# EAGLE schematic bc-module-core (EAGLE 7.7.0)

## Sheet 1 of 2
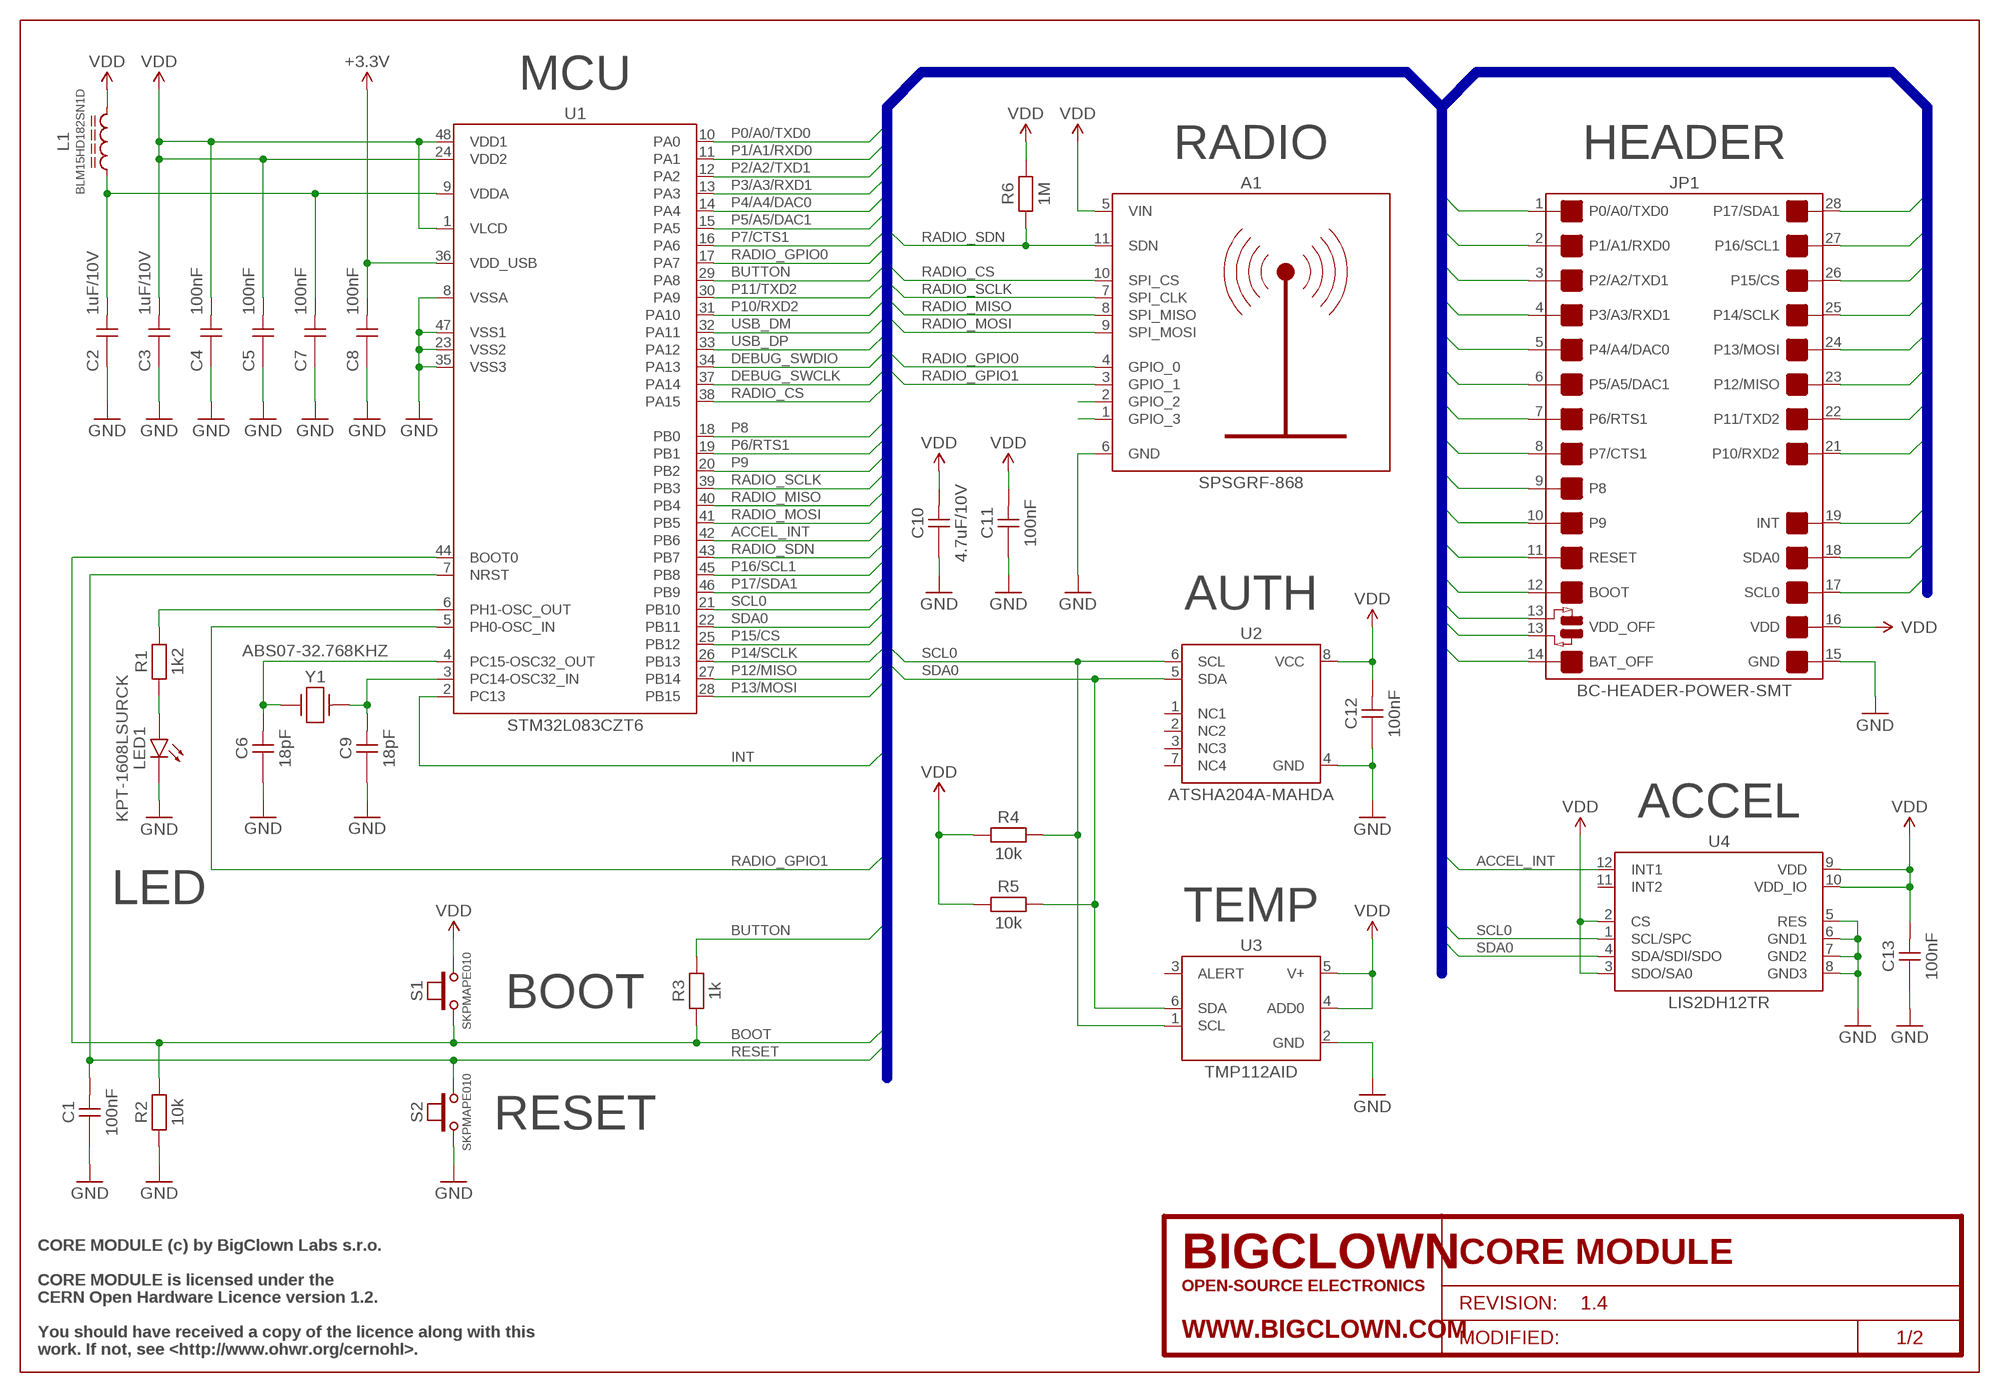
[diagram p0: schematic, sheet 1]

### Parts
A1  SPSGRF-868  A-SPSGRF  [SPSGRF_R]
C1  100nF  C-0402-100NF  [CAPACITOR-0402_R]
C2  1uF/10V  C-0402-1UF-10V  [CAPACITOR-0402_R]
C3  1uF/10V  C-0402-1UF-10V  [CAPACITOR-0402_R]
C4  100nF  C-0402-100NF  [CAPACITOR-0402_R]
C5  100nF  C-0402-100NF  [CAPACITOR-0402_R]
C6  18pF  C-0402-18PF  [CAPACITOR-0402_R]
C7  100nF  C-0402-100NF  [CAPACITOR-0402_R]
C8  100nF  C-0402-100NF  [CAPACITOR-0402_R]
C9  18pF  C-0402-18PF  [CAPACITOR-0402_R]
C10  4.7uF/10V  C-0402-4.7UF-10V  [CAPACITOR-0402_R]
C11  100nF  C-0402-100NF  [CAPACITOR-0402_R]
C12  100nF  C-0402-100NF  [CAPACITOR-0402_R]
C13  100nF  C-0402-100NF  [CAPACITOR-0402_R]
FRAME1  FRAME-SCH/A4L-BRD/A4L  [FRAME-A4L]
JP1  BC-HEADER-POWER-SMT  [BC-HEADER-POWER-SMT]
L1  BLM15HD182SN1D  L-BLM15HD182SN1D  [INDUCTOR-0402_R]
LED1  KPT-1608LSURCK  LED-KPT-1608LSURCK  [KPT-1608LSURCK_R]
R1  1k2  R-0402-1K2  [RESISTOR-0402_R]
R2  10k  R-0402-10K  [RESISTOR-0402_R]
R3  1k  R-0402-1K  [RESISTOR-0402_R]
R4  10k  R-0402-10K  [RESISTOR-0402_R]
R5  10k  R-0402-10K  [RESISTOR-0402_R]
R6  1M  R-0402-1M  [RESISTOR-0402_R]
S1  SKPMAPE010  S-SKPMAPE010  [SKPMAPE010_R]
S2  SKPMAPE010  S-SKPMAPE010  [SKPMAPE010_R]
U1  STM32L083CZT6  U-STM32L083CZT6  [STM32L083CZT6_R]
U2  ATSHA204A-MAHDA  U-ATSHA204A-MAHDA  [ATSHA204A-MAHDA_R]
U3  TMP112AID  U-TMP112AID  [TMP112AID_R]
U4  LIS2DH12TR  U-LIS2DH12TR  [LIS2DH12TR_R]
Y1  ABS07-32.768KHZ  Y-ABS07-32.768KHZ  [ABS07-32.768KHZ_R]

### Nets
+3.3V: C8.1 U1.36(VDD_USB) ; also sheet 2
ACCEL_INT: U1.42(PB6) U4.12(INT1)
BAT_OFF: JP1.14(BAT_OFF) ; also sheet 2
BOOT: JP1.12(BOOT) R2.2 R3.1 S1.1 U1.44(BOOT0)
BUTTON: R3.2 U1.29(PA8)
DEBUG_SWCLK: U1.37(PA14) ; also sheet 2
DEBUG_SWDIO: U1.34(PA13) ; also sheet 2
GND: A1.6(GND) C1.2 C2.2 C3.2 C4.2 C5.2 C6.2 C7.2 C8.2 C9.2 C10.2 C11.2 C12.2 C13.2 JP1.15(GND) LED1.C R2.1 S2.1 U1.8(VSSA) U1.23(VSS2) U1.35(VSS3) U1.47(VSS1) U2.4(GND) U3.2(GND) U4.5(RES) U4.6(GND1) U4.7(GND2) U4.8(GND3) ; also sheet 2
INT: JP1.19(INT) U1.2(PC13)
LED: R1.2 U1.6(PH1-OSC_OUT)
LED_ANODE: LED1.A R1.1
OSC32_IN: C9.1 U1.3(PC14-OSC32_IN) Y1.1
OSC32_OUT: C6.1 U1.4(PC15-OSC32_OUT) Y1.2
P0/A0/TXD0: JP1.1(P0/A0/TXD0) U1.10(PA0)
P1/A1/RXD0: JP1.2(P1/A1/RXD0) U1.11(PA1)
P2/A2/TXD1: JP1.3(P2/A2/TXD1) U1.12(PA2)
P3/A3/RXD1: JP1.4(P3/A3/RXD1) U1.13(PA3)
P4/A4/DAC0: JP1.5(P4/A4/DAC0) U1.14(PA4)
P5/A5/DAC1: JP1.6(P5/A5/DAC1) U1.15(PA5)
P6/RTS1: JP1.7(P6/RTS1) U1.19(PB1)
P7/CTS1: JP1.8(P7/CTS1) U1.16(PA6)
P8: JP1.9(P8) U1.18(PB0)
P9: JP1.10(P9) U1.20(PB2)
P10/RXD2: JP1.21(P10/RXD2) U1.31(PA10)
P11/TXD2: JP1.22(P11/TXD2) U1.30(PA9)
P12/MISO: JP1.23(P12/MISO) U1.27(PB14)
P13/MOSI: JP1.24(P13/MOSI) U1.28(PB15)
P14/SCLK: JP1.25(P14/SCLK) U1.26(PB13)
P15/CS: JP1.26(P15/CS) U1.25(PB12)
P16/SCL1: JP1.27(P16/SCL1) U1.45(PB8)
P17/SDA1: JP1.28(P17/SDA1) U1.46(PB9)
RADIO_CS: A1.10(SPI_CS) U1.38(PA15)
RADIO_GPIO0: A1.4(GPIO_0) U1.17(PA7)
RADIO_GPIO1: A1.3(GPIO_1) U1.5(PH0-OSC_IN)
RADIO_GPIO2: A1.2(GPIO_2)
RADIO_GPIO3: A1.1(GPIO_3)
RADIO_MISO: A1.8(SPI_MISO) U1.40(PB4)
RADIO_MOSI: A1.9(SPI_MOSI) U1.41(PB5)
RADIO_SCLK: A1.7(SPI_CLK) U1.39(PB3)
RADIO_SDN: A1.11(SDN) R6.1 U1.43(PB7)
RESET: C1.1 JP1.11(RESET) S2.2 U1.7(NRST) ; also sheet 2
SCL0: JP1.17(SCL0) R4.2 U1.21(PB10) U2.6(SCL) U3.1(SCL) U4.1(SCL/SPC)
SDA0: JP1.18(SDA0) R5.2 U1.22(PB11) U2.5(SDA) U3.6(SDA) U4.4(SDA/SDI/SDO)
USB_DM: U1.32(PA11) ; also sheet 2
USB_DP: U1.33(PA12) ; also sheet 2
VDD: A1.5(VIN) C3.1 C4.1 C5.1 C10.1 C11.1 C12.1 C13.1 JP1.16(VDD) L1.2 R4.1 R5.1 R6.2 S1.2 U1.1(VLCD) U1.24(VDD2) U1.48(VDD1) U2.8(VCC) U3.4(ADD0) U3.5(V+) U4.2(CS) U4.3(SDO/SA0) U4.9(VDD) U4.10(VDD_IO) ; also sheet 2
VDD_OFF_IN: JP1.13B(VDD_OFF_OUT) ; also sheet 2
VDD_OFF_OUT: JP1.13T(VDD_OFF_IN) ; also sheet 2
VDDA: C2.1 C7.1 L1.1 U1.9(VDDA)
Unconnected: U2.1(NC1) U2.2(NC2) U2.3(NC3) U2.7(NC4) U3.3(ALERT) U4.11(INT2)

### Buses
RESET,BOOT,VDD_OFF_OUT,VDD_OFF_IN,BAT_OFF,INT,SDA0,SCL0,DEBUG_SWCLK,DEBUG_SWDIO,USB_DP,USB_DM,BUTTON,ACCEL_INT,RADIO_SDN,RADIO_CS,RADIO_SCLK,RADIO_MISO,RADIO_MOSI,RADIO_GPIO0,RADIO_GPIO1,P0/A0/TXD0,P1/A1/RXD0,P2/A2/TXD1,P3/A3/RXD1,P4/A4/DAC0,P5/A5/DAC1,P6/RTS1,P7/CTS1,P8,P9,P10/RXD2,P11/TXD2,P12/MISO,P13/MOSI,P14/SCLK,P15/CS,P16/SCL1,P17/SDA1

### Notes on the sheet
- MCU
- RADIO | HEADER
- AUTH
- ACCEL
- LED
- TEMP
- BOOT
- RESET
- CORE MODULE (c) by BigClown Labs s.r.o.
- CORE MODULE is licensed under the
- CERN Open Hardware Licence version 1.2.
- You should have received a copy of the licence along with this
- work. If not, see <http://www.ohwr.org/cernohl>.

## Sheet 2 of 2
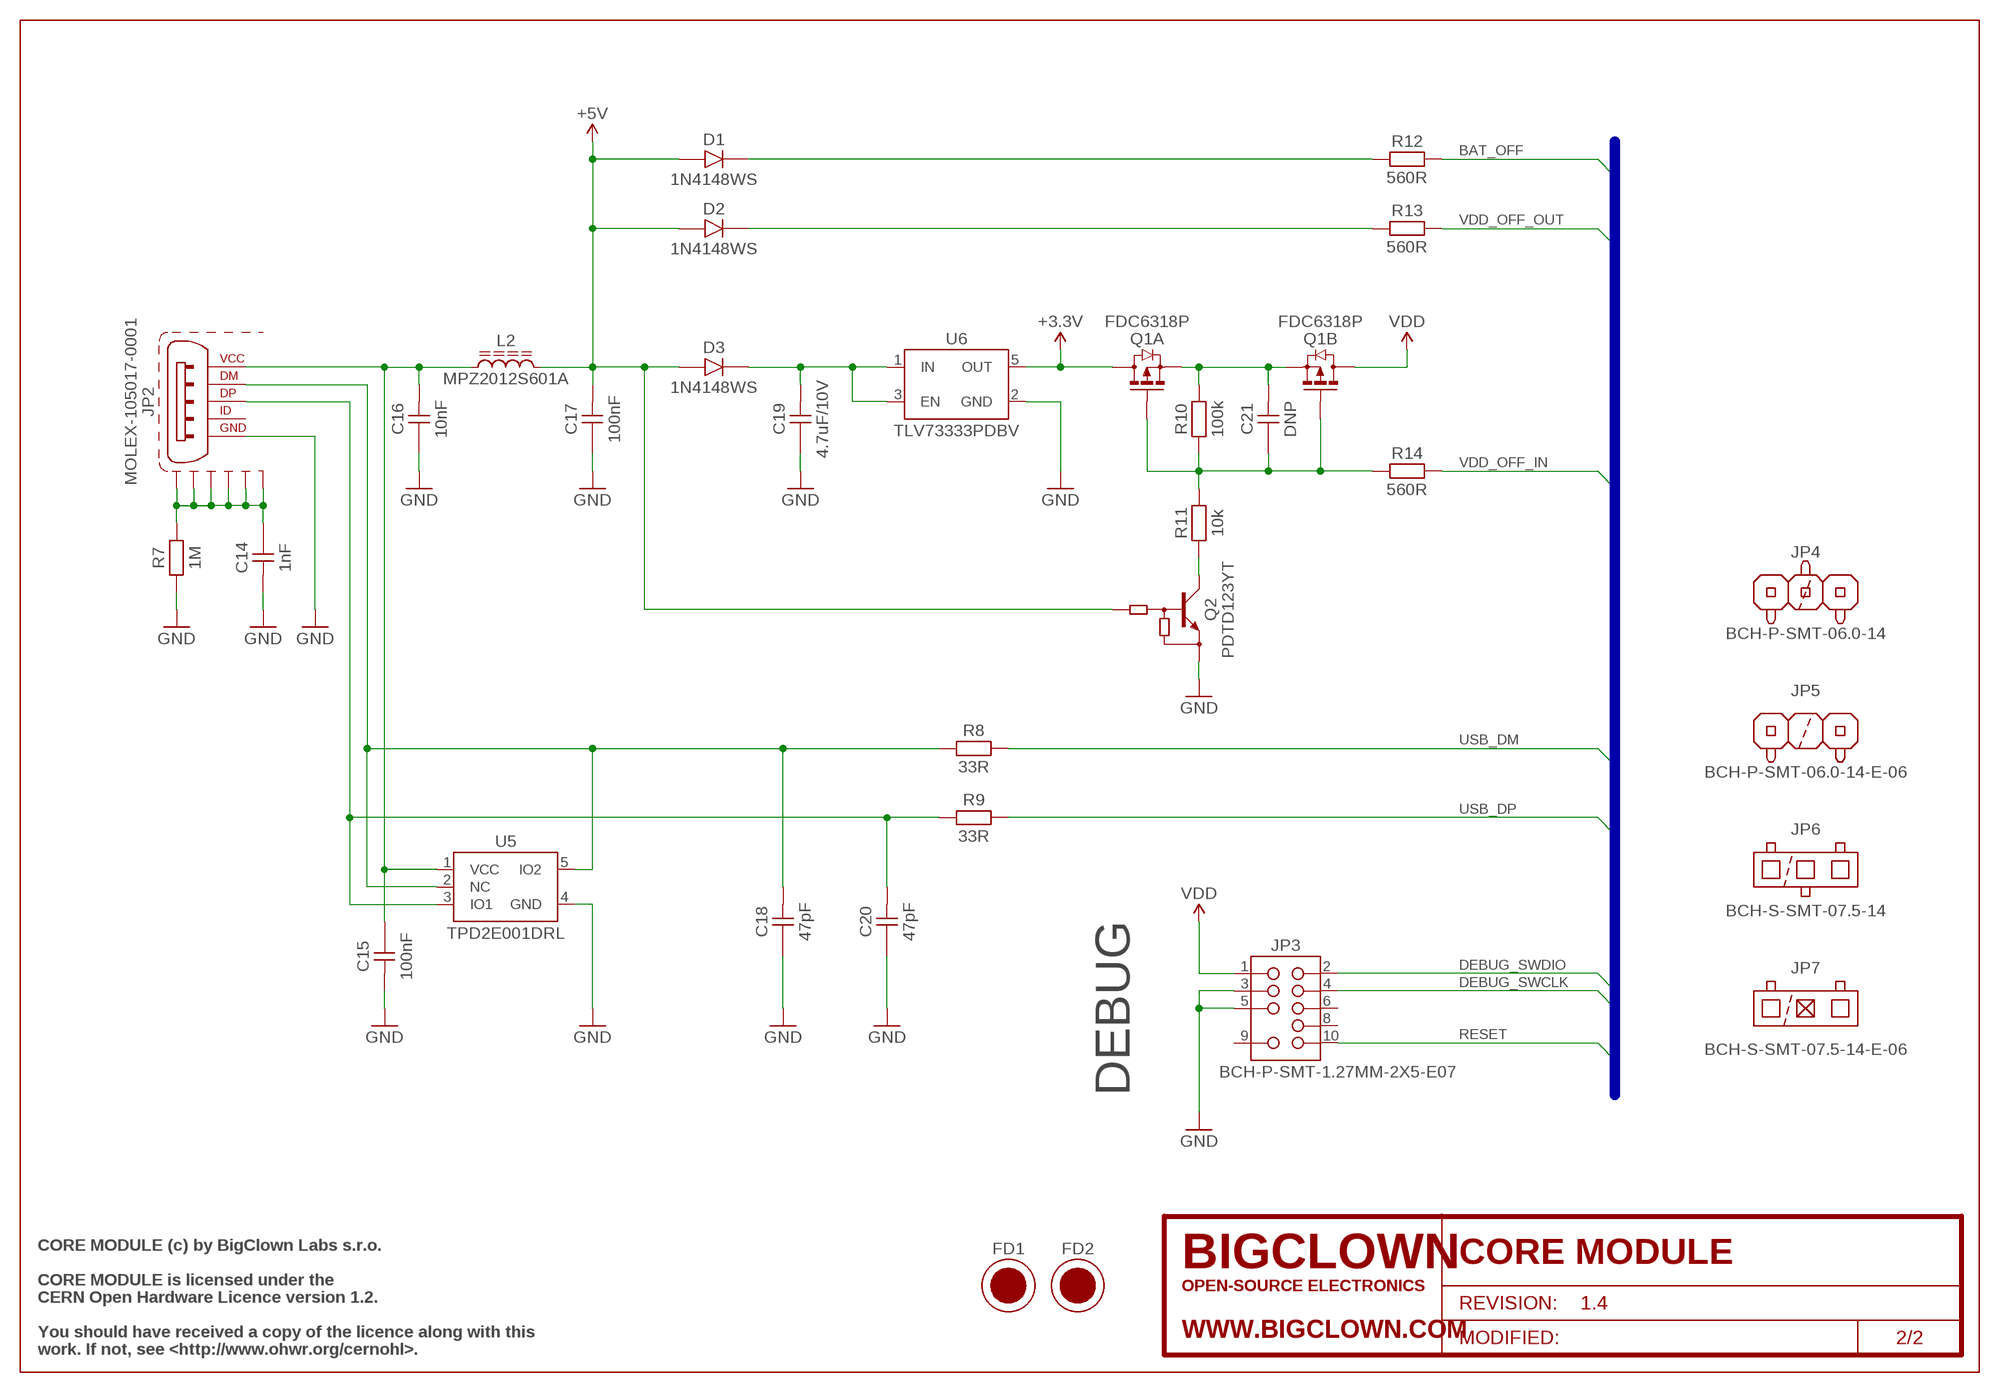
[diagram p1: schematic, sheet 2]
FRAME2 (FRAME-SCH/A4L-BRD/NONE): BCPN: -; PROJECT_NAME: CORE MODULE; PROJECT_REVISION: 1.4

### Parts
C14  1nF  C-1206-1NF  [CAPACITOR-1206_R]
C15  100nF  C-1206-100NF  [CAPACITOR-1206_R]
C16  10nF  C-0402-10NF  [CAPACITOR-0402_R]
C17  100nF  C-0402-100NF  [CAPACITOR-0402_R]
C18  47pF  C-0402-47PF  [CAPACITOR-0402_R]
C19  4.7uF/10V  C-0402-4.7UF-10V  [CAPACITOR-0402_R]
C20  47pF  C-0402-47PF  [CAPACITOR-0402_R]
C21  DNP  C-0402-DNP  [CAPACITOR-0402_R]
D1  1N4148WS  D-1N4148WS  [SOD-323_R]
D2  1N4148WS  D-1N4148WS  [SOD-323_R]
D3  1N4148WS  D-1N4148WS  [SOD-323_R]
FD1  FIDUCIAL  [FIDUCIAL-1MM]
FD2  FIDUCIAL  [FIDUCIAL-1MM]
JP2  MOLEX-105017-0001  JP-MOLEX-105017-0001  [MOLEX-105017-0001_R]
JP3  BCH-P-SMT-1.27MM-2X5-E07  JP-BCH-P-SMT-1.27MM-2X5-E07  [BCH-P-SMT-1.27MM-2X5-E07]
JP4  BCH-P-SMT-06.0-14  JP-BCH-P-SMT-06.0-14  [BCH-P-SMT-14]
JP5  BCH-P-SMT-06.0-14-E-06  JP-BCH-P-SMT-06.0-14-E-06  [BCH-P-SMT-14-E-06]
JP6  BCH-S-SMT-07.5-14  JP-BCH-S-SMT-07.5-14  [BCH-S-SMT-14]
JP7  BCH-S-SMT-07.5-14-E-06  JP-BCH-S-SMT-07.5-14-E-06  [BCH-S-SMT-14-E-06]
L2  MPZ2012S601A  L-MPZ2012S601A  [INDUCTOR-0805_R]
Q1  FDC6318P  Q-FDC6318P  [SSOT-6L_R]
Q2  PDTD123YT  Q-PDTD123YT  [SOT-23_R]
R7  1M  R-1206-1M  [RESISTOR-1206_R]
R8  33R  R-0402-33R  [RESISTOR-0402_R]
R9  33R  R-0402-33R  [RESISTOR-0402_R]
R10  100k  R-0402-100K  [RESISTOR-0402_R]
R11  10k  R-0402-10K  [RESISTOR-0402_R]
R12  560R  R-0402-560R  [RESISTOR-0402_R]
R13  560R  R-0402-560R  [RESISTOR-0402_R]
R14  560R  R-0402-560R  [RESISTOR-0402_R]
U5  TPD2E001DRL  U-TPD2E001DRL  [TPD2E001DRL_R]
U6  TLV73333PDBV  U-TLV73333PDBV  [TLV73333PDBV_R]

### Nets
+3.3V: Q1.6(A:D) U6.5(OUT) ; also sheet 1
+5V: C17.1 D1.2(A) D2.2(A) D3.2(A) L2.2 Q2.1(B)
+5V_RECTIFIED_BAT_OFF: D1.1(C) R12.1
+5V_RECTIFIED_LDO: C19.1 D3.1(C) U6.1(IN) U6.3(EN)
+5V_RECTIFIED_VDD_OFF_OUT: D2.1(C) R13.1
BAT_OFF: R12.2 ; also sheet 1
DEBUG_SWCLK: JP3.4 ; also sheet 1
DEBUG_SWDIO: JP3.2 ; also sheet 1
DM: C18.1 JP2.2 R8.1 U5.2(NC) U5.5(IO2)
DP: C20.1 JP2.3 R9.1 U5.3(IO1)
GND: C14.1 C15.1 C16.2 C17.2 C18.2 C19.2 C20.2 JP2.5 JP3.3 JP3.5 Q2.2(E) R7.1 U5.4(GND) U6.2(GND) ; also sheet 1
RESET: JP3.10 ; also sheet 1
SHIELD: C14.2 JP2.S1 JP2.S2 JP2.S3 JP2.S4 JP2.S5 JP2.S6 R7.2
USB_DM: R8.2 ; also sheet 1
USB_DP: R9.2 ; also sheet 1
USB_VCC: C15.2 C16.1 JP2.1 L2.1 U5.1(VCC)
VDD: JP3.1 Q1.4(B:D) ; also sheet 1
VDD_OFF_IN: R14.2 ; also sheet 1
VDD_OFF_IN_C: Q2.3(C) R11.1
VDD_OFF_IN_G: C21.2 Q1.1(A:G) Q1.3(B:G) R10.1 R11.2 R14.1
VDD_OFF_OUT: R13.2 ; also sheet 1
VDD_S: C21.1 Q1.2(B:S) Q1.5(A:S) R10.2
Unconnected: JP2.4 JP3.6 JP3.8 JP3.9

### Buses
RESET,BOOT,VDD_OFF_OUT,VDD_OFF_IN,BAT_OFF,INT,SDA0,SCL0,DEBUG_SWCLK,DEBUG_SWDIO,USB_DP,USB_DM,BUTTON,ACCEL_INT,RADIO_SDN,RADIO_CS,RADIO_SCLK,RADIO_MISO,RADIO_MOSI,RADIO_GPIO0,RADIO_GPIO1,P0/A0/TXD0,P1/A1/RXD0,P2/A2/TXD1,P3/A3/RXD1,P4/A4/DAC0,P5/A5/DAC1,P6/RTS1,P7/CTS1,P8,P9,P10/RXD2,P11/TXD2,P12/MISO,P13/MOSI,P14/SCLK,P15/CS,P16/SCL1,P17/SDA1

### Notes on the sheet
- DEBUG
- CORE MODULE (c) by BigClown Labs s.r.o.
- CORE MODULE is licensed under the
- CERN Open Hardware Licence version 1.2.
- You should have received a copy of the licence along with this
- work. If not, see <http://www.ohwr.org/cernohl>.

## Library data of the parts
A1 = bc-radio:A-SPSGRF; BCPN: BC-A-SPSGRF-868
C1 C4 C5 C7 C8 C11-C13 C17 = bc-capacitor:C-0402-100NF; BCPN: BC-C-0402-100NF
C2 C3 = bc-capacitor:C-0402-1UF-10V; BCPN: BC-C-0402-1UF-10V
C6 C9 = bc-capacitor:C-0402-18PF; BCPN: BC-C-0402-18PF
C10 C19 = bc-capacitor:C-0402-4.7UF-10V; BCPN: BC-C-0402-4.7UF-10V
C14 = bc-capacitor:C-1206-1NF; BCPN: BC-C-1206-1NF
C15 = bc-capacitor:C-1206-100NF; BCPN: BC-C-1206-100NF
C16 = bc-capacitor:C-0402-10NF; BCPN: BC-C-0402-10NF
C18 C20 = bc-capacitor:C-0402-47PF; BCPN: BC-C-0402-47pF
C21 = bc-capacitor:C-0402-DNP; BCPN: -
D1-D3 = bc-discrete:D-1N4148WS; BCPN: BC-D-1N4148WS
FD1 FD2 = bc-fiducial:FIDUCIAL; BCPN: -
FRAME1 = bc-frame:FRAME-SCH/A4L-BRD/A4L; BCPN: -; PROJECT_NAME: CORE MODULE; PROJECT_REVISION: 1.4
JP1 = bc-header:BC-HEADER-POWER-SMT; BCPN: -
JP2 = bc-connector:JP-MOLEX-105017-0001; BCPN: BC-JP-MOLEX-105017-0001
JP3 = bc-header:JP-BCH-P-SMT-1.27MM-2X5-E07; BCPN: BC-JP-BCH-P-SMT-1.27MM-2X5-E07
JP4 = bc-header:JP-BCH-P-SMT-06.0-14; BCPN: BC-JP-BCH-P-SMT-06.0-14
JP5 = bc-header:JP-BCH-P-SMT-06.0-14-E-06; BCPN: BC-JP-BCH-P-SMT-06.0-14-E-06
JP6 = bc-header:JP-BCH-S-SMT-07.5-14; BCPN: BC-JP-BCH-S-SMT-07.5-14
JP7 = bc-header:JP-BCH-S-SMT-07.5-14-E-06; BCPN: BC-JP-BCH-S-SMT-07.5-14-E-06
L1 = bc-inductor:L-BLM15HD182SN1D; BCPN: BC-L-BLM15HD182SN1D
L2 = bc-inductor:L-MPZ2012S601A; BCPN: BC-L-MPZ2012S601A
LED1 = bc-led:LED-KPT-1608LSURCK; BCPN: BC-LED-KPT-1608LSURCK
Q1 = bc-discrete:Q-FDC6318P; BCPN: BC-Q-FDC6318P
Q2 = bc-discrete:Q-PDTD123YT; BCPN: BC-Q-PDTD123YT
R1 = bc-resistor:R-0402-1K2; BCPN: BC-R-0402-1K2
R2 R4 R5 R11 = bc-resistor:R-0402-10K; BCPN: BC-R-0402-10K
R3 = bc-resistor:R-0402-1K; BCPN: BC-R-0402-1K
R6 = bc-resistor:R-0402-1M; BCPN: BC-R-0402-1M
R7 = bc-resistor:R-1206-1M; BCPN: BC-R-1206-1M
R8 R9 = bc-resistor:R-0402-33R; BCPN: BC-R-0402-33R
R10 = bc-resistor:R-0402-100K; BCPN: BC-R-0402-100k
R12-R14 = bc-resistor:R-0402-560R; BCPN: BC-R-0402-560R
S1 S2 = bc-switch:S-SKPMAPE010; BCPN: BC-S-SKPMAPE010
U1 = bc-microcontroller:U-STM32L083CZT6; BCPN: BC-U-STM32L083CZT6
U2 = bc-memory:U-ATSHA204A-MAHDA; BCPN: BC-U-ATSHA204A-MAHDA
U3 = bc-sensor:U-TMP112AID; BCPN: BC-U-TMP112AID
U4 = bc-sensor:U-LIS2DH12TR; BCPN: BC-U-LIS2DH12TR
U5 = bc-protection:U-TPD2E001DRL; BCPN: BC-U-TPD2E001DRL
U6 = bc-power:U-TLV73333PDBV; BCPN: BC-U-TLV73333PDBV
Y1 = bc-crystal:Y-ABS07-32.768KHZ; BCPN: BC-Y-ABS07-32.768KHZ